# Altium schematic sheet L Subsys.SchDoc
size A; SheetNumber: 7; SheetTotal: 7
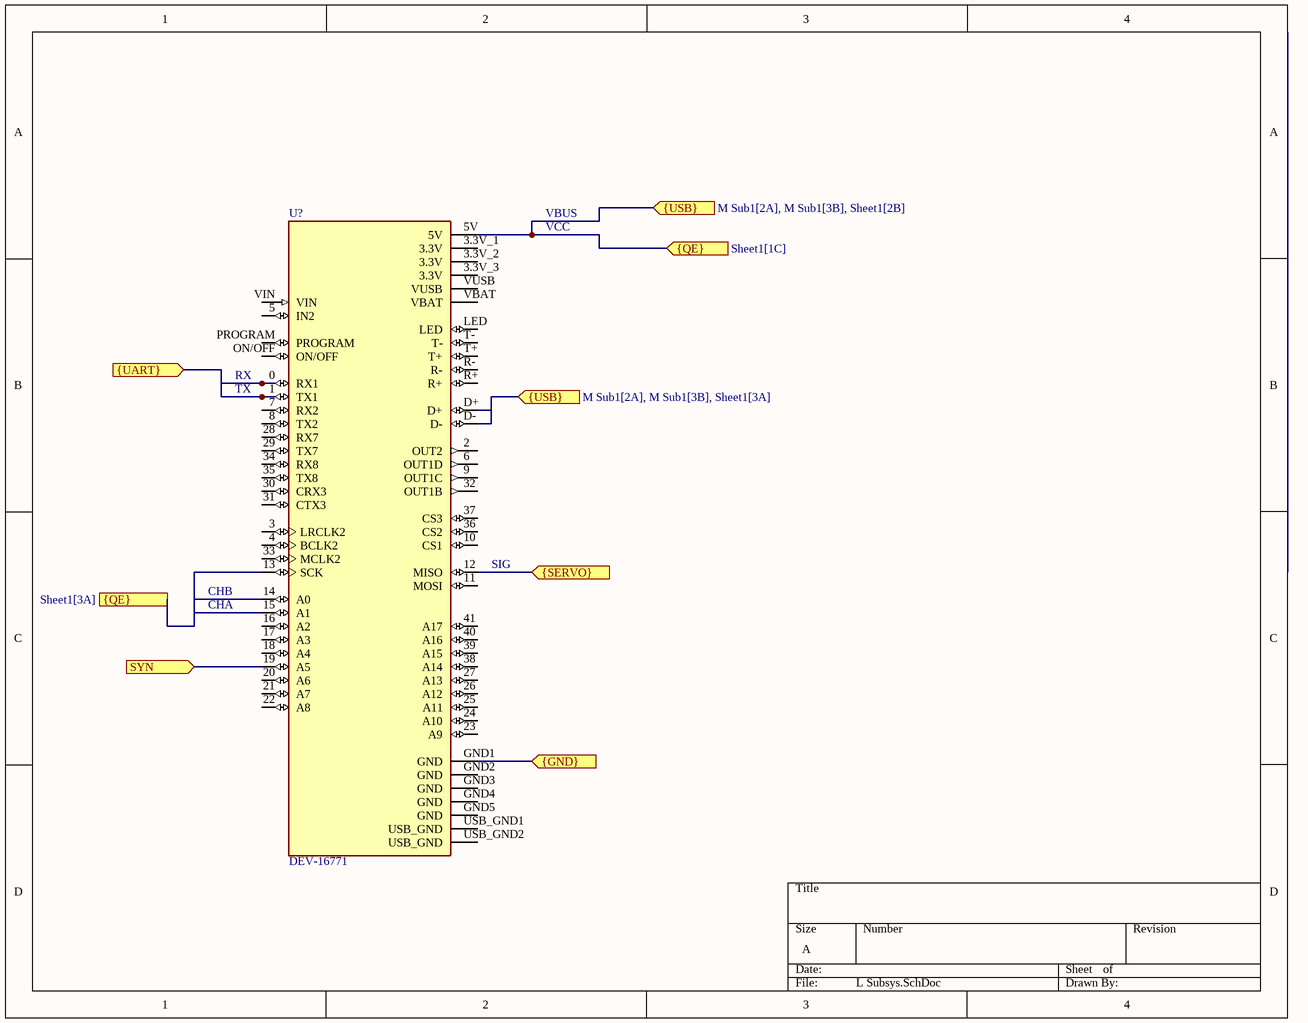
[diagram p0: L Subsys.SchDoc]

## Parts
U?  DEV-16771  [MODULE_DEV-16771]

## Ports
SYN (in), {GND} (in), {QE} (in, see Sheet1[1C]), {QE} (see Sheet1[3A]), {SERVO} (in), {UART} (in), {USB} (in, see M Sub1[2A], M Sub1[3B], Sheet1[2B]), {USB} (in, see M Sub1[2A], M Sub1[3B], Sheet1[3A])

## Nets
SYN: U?.19(A5) ; port SYN
{GND}: U?.GND1(GND) ; port {GND}
{SERVO}: U?.12(MISO) ; port {SERVO}

Not connected (* = marked no-connect by the designer): U? 0(RX1) 1(TX1) 2(OUT2) 3(LRCLK2) 3.3V_1(3.3V) 3.3V_2(3.3V) 3.3V_3(3.3V) 4(BCLK2) 5(IN2) 5V 6(OUT1D) 7(RX2) 8(TX2) 9(OUT1C) 10(CS1) 11(MOSI) 13(SCK) 14(A0) 15(A1) 16(A2) 17(A3) 18(A4) 20(A6) 21(A7) 22(A8) 23(A9) 24(A10) 25(A11) 26(A12) 27(A13) 28(RX7) 29(TX7) 30(CRX3) 31(CTX3) 32(OUT1B) 33(MCLK2) 34(RX8) 35(TX8) 36(CS2) 37(CS3) 38(A14) 39(A15) 40(A16) 41(A17) D+ D- GND2(GND) GND3(GND) GND4(GND) GND5(GND) LED ON/OFF PROGRAM R+ R- T+ T- USB_GND1(USB_GND) USB_GND2(USB_GND) VBAT VIN VUSB

## Notes on the sheet
- VCC
- VBUS
- (near U?) TX
- (near U?) RX
- (near U?) SIG
- CHB
- CHA

## Library data of the parts
U? = CMP-010-000000-1: RT1062 Teensy 4.1 series ARM® Cortex®-M7 MPU Embedded Evaluation Board; MF: SparkFun Electronics; MP: DEV-16771; Pin Count: 65; Check_prices: https://www.snapeda.com/parts/DEV-16771/SparkFun+Electronics/view-part/?ref=eda; Value: *; Component Type: Standard; SnapEDA_Link: https://www.snapeda.com/parts/DEV-16771/SparkFun+Electronics/view-part/?ref=snap; Source: DEV-16771.SchLib; Package: None; Design Item ID: DEV-16771